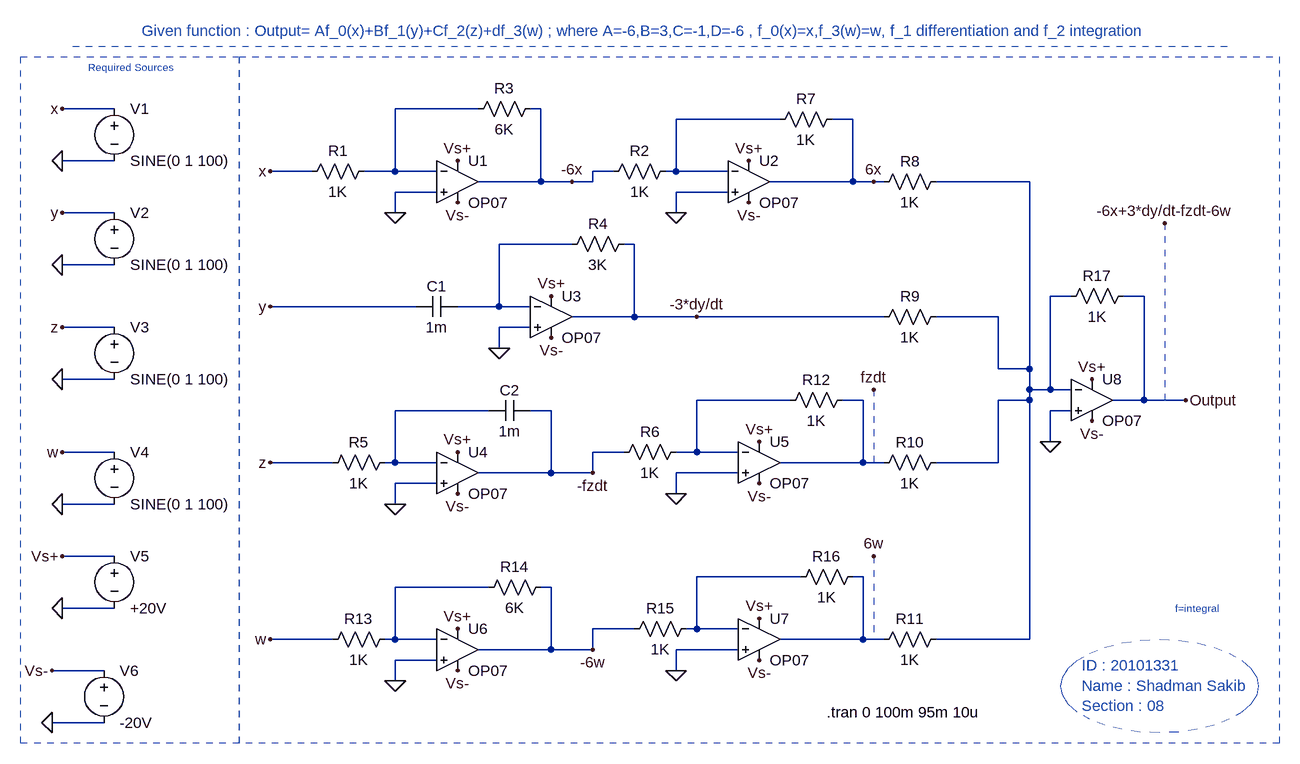
[diagram p0: schematic Project_20101331_Shadman Sakib_CSE251.asc]
Project_20101331_Shadman Sakib_CSE251.asc, the LTspice schematic file:
Version 4
SHEET 1 1052 680
WIRE -976 -752 -1056 -752
WIRE -416 -752 -544 -752
WIRE -320 -752 -336 -752
WIRE 48 -736 -112 -736
WIRE 160 -736 128 -736
WIRE -976 -672 -1056 -672
WIRE -672 -656 -736 -656
WIRE -544 -656 -544 -752
WIRE -544 -656 -592 -656
WIRE -480 -656 -544 -656
WIRE -208 -656 -240 -656
WIRE -112 -656 -112 -736
WIRE -112 -656 -128 -656
WIRE -32 -656 -112 -656
WIRE -320 -640 -320 -752
WIRE -320 -640 -416 -640
WIRE -272 -640 -320 -640
WIRE -240 -640 -240 -656
WIRE -240 -640 -272 -640
WIRE 160 -640 160 -736
WIRE 160 -640 32 -640
WIRE 192 -640 160 -640
WIRE 208 -640 192 -640
WIRE 432 -640 288 -640
WIRE -480 -624 -544 -624
WIRE -32 -624 -112 -624
WIRE -976 -592 -1056 -592
WIRE -544 -592 -544 -624
WIRE -112 -592 -112 -624
WIRE -272 -544 -384 -544
WIRE -176 -544 -192 -544
WIRE -976 -512 -1056 -512
WIRE 496 -464 464 -464
WIRE 608 -464 576 -464
WIRE -512 -448 -736 -448
WIRE -384 -448 -384 -544
WIRE -384 -448 -448 -448
WIRE -336 -448 -384 -448
WIRE -176 -432 -176 -544
WIRE -176 -432 -272 -432
WIRE -80 -432 -176 -432
WIRE 208 -432 -80 -432
WIRE 384 -432 288 -432
WIRE -976 -416 -1056 -416
WIRE -336 -416 -384 -416
WIRE -384 -384 -384 -416
WIRE 384 -352 384 -432
WIRE 432 -352 432 -640
WIRE 432 -352 384 -352
WIRE -976 -336 -1056 -336
WIRE 432 -320 432 -352
WIRE 464 -320 464 -464
WIRE 464 -320 432 -320
WIRE 496 -320 464 -320
WIRE 64 -304 -80 -304
WIRE 176 -304 144 -304
WIRE 432 -304 432 -320
WIRE 432 -304 384 -304
WIRE 608 -304 608 -464
WIRE 608 -304 560 -304
WIRE 672 -304 608 -304
WIRE -400 -288 -544 -288
WIRE -304 -288 -336 -288
WIRE 496 -288 464 -288
WIRE 464 -240 464 -288
WIRE -976 -224 -1056 -224
WIRE -192 -224 -240 -224
WIRE -80 -224 -80 -304
WIRE -80 -224 -112 -224
WIRE -16 -224 -80 -224
WIRE -640 -208 -736 -208
WIRE -544 -208 -544 -288
WIRE -544 -208 -560 -208
WIRE -480 -208 -544 -208
WIRE 176 -208 176 -304
WIRE 176 -208 48 -208
WIRE 208 -208 176 -208
WIRE 384 -208 384 -304
WIRE 384 -208 288 -208
WIRE -304 -192 -304 -288
WIRE -304 -192 -416 -192
WIRE -240 -192 -240 -224
WIRE -240 -192 -304 -192
WIRE -16 -192 -112 -192
WIRE -480 -176 -544 -176
WIRE -112 -160 -112 -192
WIRE -976 -144 -1056 -144
WIRE -544 -144 -544 -176
WIRE -976 -64 -1056 -64
WIRE 80 -32 -80 -32
WIRE 176 -32 160 -32
WIRE -400 -16 -544 -16
WIRE -304 -16 -320 -16
WIRE -976 16 -1056 16
WIRE -176 48 -240 48
WIRE -80 48 -80 -32
WIRE -80 48 -96 48
WIRE -16 48 -80 48
WIRE -640 64 -736 64
WIRE -544 64 -544 -16
WIRE -544 64 -560 64
WIRE -480 64 -544 64
WIRE 176 64 176 -32
WIRE 176 64 48 64
WIRE 208 64 176 64
WIRE 432 64 432 -304
WIRE 432 64 288 64
WIRE -304 80 -304 -16
WIRE -304 80 -416 80
WIRE -240 80 -240 48
WIRE -240 80 -304 80
WIRE -16 80 -112 80
WIRE -480 96 -544 96
WIRE -992 112 -1072 112
WIRE -112 112 -112 80
WIRE -544 128 -544 96
WIRE -992 192 -1072 192
FLAG -1056 -672 0
FLAG -1056 -512 0
FLAG -1056 -336 0
FLAG -1056 -144 0
FLAG -1056 16 0
FLAG -1072 192 0
FLAG -1056 -752 x
FLAG -1056 -592 y
FLAG -1056 -416 z
FLAG -1056 -224 w
FLAG -1056 -64 Vs+
FLAG -1072 112 Vs-
FLAG -544 -592 0
FLAG -112 -592 0
FLAG -736 -656 x
FLAG -448 -672 Vs+
FLAG -448 -608 Vs-
FLAG -304 -464 Vs+
FLAG -448 -224 Vs+
FLAG 16 -240 Vs+
FLAG 528 -336 Vs+
FLAG 16 32 Vs+
FLAG -448 48 Vs+
FLAG -304 -400 Vs-
FLAG -448 -160 Vs-
FLAG 16 -176 Vs-
FLAG 528 -272 Vs-
FLAG 16 96 Vs-
FLAG -448 112 Vs-
FLAG 0 -608 Vs-
FLAG 0 -672 Vs+
FLAG -736 -448 y
FLAG -384 -384 0
FLAG -544 -144 0
FLAG -112 -160 0
FLAG -736 -208 z
FLAG -544 128 0
FLAG -112 112 0
FLAG -736 64 w
FLAG 464 -240 0
FLAG 672 -304 Output
FLAG -272 -640 -6x
FLAG 192 -640 6x
FLAG -80 -432 -3*dy/dt
FLAG -240 -192 -fzdt
FLAG 192 -320 fzdt
FLAG -240 80 -6w
FLAG 192 -64 6w
FLAG 640 -576 -6x+3*dy/dt-fzdt-6w
SYMBOL voltage -976 -768 R0
WINDOW 123 0 0 Left 0
WINDOW 39 0 0 Left 0
SYMATTR InstName V1
SYMATTR Value SINE(0 1 100)
SYMBOL voltage -976 -608 R0
WINDOW 123 0 0 Left 0
WINDOW 39 0 0 Left 0
SYMATTR InstName V2
SYMATTR Value SINE(0 1 100)
SYMBOL voltage -976 -432 R0
WINDOW 123 0 0 Left 0
WINDOW 39 0 0 Left 0
SYMATTR InstName V3
SYMATTR Value SINE(0 1 100)
SYMBOL voltage -976 -240 R0
WINDOW 123 0 0 Left 0
WINDOW 39 0 0 Left 0
SYMATTR InstName V4
SYMATTR Value SINE(0 1 100)
SYMBOL voltage -976 -80 R0
WINDOW 123 0 0 Left 0
WINDOW 39 0 0 Left 0
SYMATTR InstName V5
SYMATTR Value +20V
SYMBOL voltage -992 96 R0
WINDOW 123 0 0 Left 0
WINDOW 39 0 0 Left 0
SYMATTR InstName V6
SYMATTR Value -20V
SYMBOL res -576 -672 R90
WINDOW 0 0 56 VBottom 2
WINDOW 3 32 56 VTop 2
SYMATTR InstName R1
SYMATTR Value 1K
SYMBOL OpAmps\\OP07 -448 -704 R0
SYMATTR InstName U1
SYMBOL OpAmps\\OP07 0 -704 R0
SYMATTR InstName U2
SYMBOL OpAmps\\OP07 -304 -496 R0
SYMATTR InstName U3
SYMBOL OpAmps\\OP07 -448 -256 R0
SYMATTR InstName U4
SYMBOL OpAmps\\OP07 16 -272 R0
SYMATTR InstName U5
SYMBOL OpAmps\\OP07 -448 16 R0
SYMATTR InstName U6
SYMBOL OpAmps\\OP07 16 0 R0
SYMATTR InstName U7
SYMBOL OpAmps\\OP07 528 -368 R0
SYMATTR InstName U8
SYMBOL res -112 -672 R90
WINDOW 0 0 56 VBottom 2
WINDOW 3 32 56 VTop 2
SYMATTR InstName R2
SYMATTR Value 1K
SYMBOL cap -448 -464 R90
WINDOW 0 0 32 VBottom 2
WINDOW 3 32 32 VTop 2
SYMATTR InstName C1
SYMATTR Value 1m
SYMBOL res -176 -560 R90
WINDOW 0 0 56 VBottom 2
WINDOW 3 32 56 VTop 2
SYMATTR InstName R4
SYMATTR Value 3K
SYMBOL res -320 -768 R90
WINDOW 0 0 56 VBottom 2
WINDOW 3 32 56 VTop 2
SYMATTR InstName R3
SYMATTR Value 6K
SYMBOL res -544 -224 R90
WINDOW 0 0 56 VBottom 2
WINDOW 3 32 56 VTop 2
SYMATTR InstName R5
SYMATTR Value 1K
SYMBOL cap -336 -304 R90
WINDOW 0 0 32 VBottom 2
WINDOW 3 32 32 VTop 2
SYMATTR InstName C2
SYMATTR Value 1m
SYMBOL res -96 -240 R90
WINDOW 0 0 56 VBottom 2
WINDOW 3 32 56 VTop 2
SYMATTR InstName R6
SYMATTR Value 1K
SYMBOL res 144 -752 R90
WINDOW 0 0 56 VBottom 2
WINDOW 3 32 56 VTop 2
SYMATTR InstName R7
SYMATTR Value 1K
SYMBOL res 304 -656 R90
WINDOW 0 0 56 VBottom 2
WINDOW 3 32 56 VTop 2
SYMATTR InstName R8
SYMATTR Value 1K
SYMBOL res 304 -448 R90
WINDOW 0 0 56 VBottom 2
WINDOW 3 32 56 VTop 2
SYMATTR InstName R9
SYMATTR Value 1K
SYMBOL res 304 -224 R90
WINDOW 0 0 56 VBottom 2
WINDOW 3 32 56 VTop 2
SYMATTR InstName R10
SYMATTR Value 1K
SYMBOL res 304 48 R90
WINDOW 0 0 56 VBottom 2
WINDOW 3 32 56 VTop 2
SYMATTR InstName R11
SYMATTR Value 1K
SYMBOL res 160 -320 R90
WINDOW 0 0 56 VBottom 2
WINDOW 3 32 56 VTop 2
SYMATTR InstName R12
SYMATTR Value 1K
SYMBOL res -544 48 R90
WINDOW 0 0 56 VBottom 2
WINDOW 3 32 56 VTop 2
SYMATTR InstName R13
SYMATTR Value 1K
SYMBOL res -304 -32 R90
WINDOW 0 0 56 VBottom 2
WINDOW 3 32 56 VTop 2
SYMATTR InstName R14
SYMATTR Value 6K
SYMBOL res -80 32 R90
WINDOW 0 0 56 VBottom 2
WINDOW 3 32 56 VTop 2
SYMATTR InstName R15
SYMATTR Value 1K
SYMBOL res 176 -48 R90
WINDOW 0 0 56 VBottom 2
WINDOW 3 32 56 VTop 2
SYMATTR InstName R16
SYMATTR Value 1K
SYMBOL res 592 -480 R90
WINDOW 0 0 56 VBottom 2
WINDOW 3 32 56 VTop 2
SYMATTR InstName R17
SYMATTR Value 1K
TEXT -952 -816 Center 1 ;Required Sources
TEXT -152 -872 Center 2 ;Given function : Output= Af_0(x)+Bf_1(y)+Cf_2(z)+df_3(w) ; where A=-6,B=3,C=-1,D=-6 , f_0(x)=x,f_3(w)=w, f_1 differentiation and f_2 integration
TEXT 512 104 Left 2 ;ID : 20101331\nName : Shadman Sakib\nSection : 08
TEXT 656 16 Left 1 ;f=integral
TEXT 120 176 Left 2 !.tran 0 100m 95m 10u
LINE Normal 192 -320 192 -208 2
LINE Normal 192 -64 192 64 2
LINE Normal 640 -576 640 -304 2
LINE Normal 736 -848 -1040 -848 1
RECTANGLE Normal -784 224 -1120 -832 2
RECTANGLE Normal 816 224 -784 -832 1
CIRCLE Normal 784 208 480 64 2

The netlist it stands for:
* Project_20101331_Shadman Sakib_CSE251.asc
V1 x 0 SINE(0 1 100)
V2 y 0 SINE(0 1 100)
V3 z 0 SINE(0 1 100)
V4 w 0 SINE(0 1 100)
V5 Vs+ 0 +20V
V6 Vs- 0 -20V
R1 N001 x 1K
XU1 0 N001 Vs+ Vs- -6x LT1001  ; OP07, pins In+ In- V+ V- OUT
XU2 0 N002 Vs+ Vs- 6x LT1001  ; OP07, pins In+ In- V+ V- OUT
XU3 0 N004 Vs+ Vs- -3*dy/dt LT1001  ; OP07, pins In+ In- V+ V- OUT
XU4 0 N007 Vs+ Vs- -fzdt LT1001  ; OP07, pins In+ In- V+ V- OUT
XU5 0 N005 Vs+ Vs- N006 LT1001  ; OP07, pins In+ In- V+ V- OUT
XU6 0 N010 Vs+ Vs- -6w LT1001  ; OP07, pins In+ In- V+ V- OUT
XU7 0 N008 Vs+ Vs- N009 LT1001  ; OP07, pins In+ In- V+ V- OUT
XU8 0 N003 Vs+ Vs- Output LT1001  ; OP07, pins In+ In- V+ V- OUT
R2 N002 -6x 1K
C1 N004 y 1m
R4 -3*dy/dt N004 3K
R3 -6x N001 6K
R5 N007 z 1K
C2 -fzdt N007 1m
R6 N005 -fzdt 1K
R7 6x N002 1K
R8 N003 6x 1K
R9 N003 -3*dy/dt 1K
R10 N003 N006 1K
R11 N003 N009 1K
R12 N006 N005 1K
R13 N010 w 1K
R14 -6w N010 6K
R15 N008 -6w 1K
R16 N009 N008 1K
R17 Output N003 1K
* Required Sources
* Given function : Output= Af_0(x)+Bf_1(y)+Cf_2(z)+df_3(w) ; where A=-6,B=3,C=-1,D=-6 , f_0(x)=x,f_3(w)=w, f_1 differentiation and f_2 integration
* ID : 20101331
* Name : Shadman Sakib
* Section : 08
* f=integral
.tran 0 100m 95m 10u
.lib LTC.lib
.backanno
.end